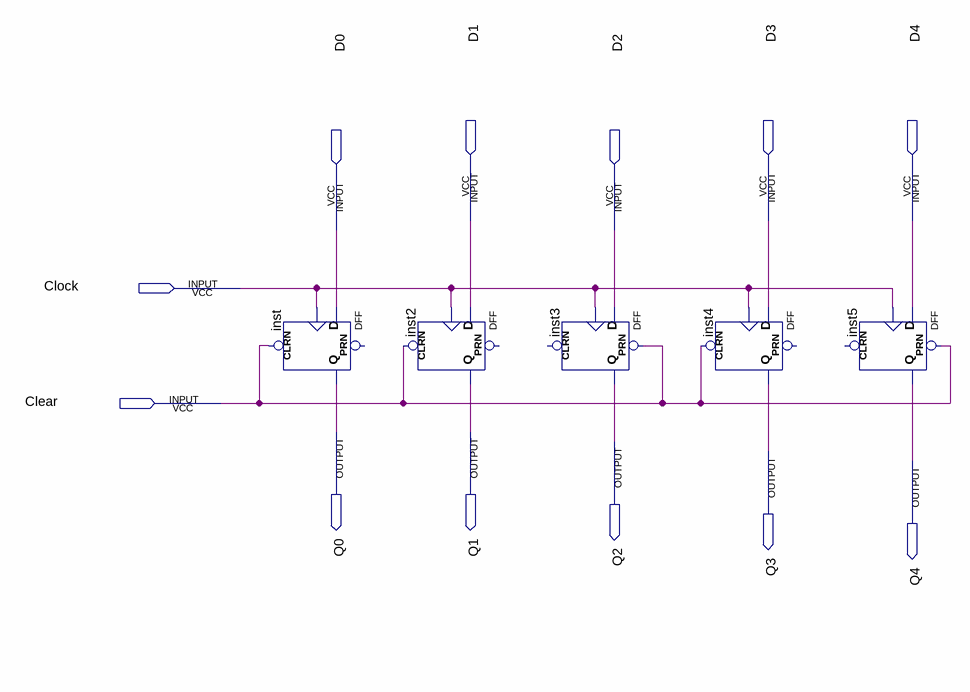
[diagram p0: schematic sheet]
// Quartus schematic userYTracker.bdf as structural Verilog: 5 symbols, 12 pins
module userYTracker (
  input  D1,
  input  D3,
  input  D4,
  input  D0,
  input  D2,
  input  Clock,
  input  Clear,
  output Q0,
  output Q1,
  output Q2,
  output Q3,
  output Q4
);

  DFF inst (.CLRN(Clear), .CLK(Clock), .D(D0), .Q(Q0));  // open: PRN
  DFF inst2 (.CLRN(Clear), .CLK(Clock), .D(D1), .Q(Q1));  // open: PRN
  DFF inst3 (.CLK(Clock), .D(D2), .PRN(Clear), .Q(Q2));  // open: CLRN
  DFF inst4 (.CLRN(Clear), .CLK(Clock), .D(D3), .Q(Q3));  // open: PRN
  DFF inst5 (.CLK(Clock), .D(D4), .PRN(Clear), .Q(Q4));  // open: CLRN
endmodule
